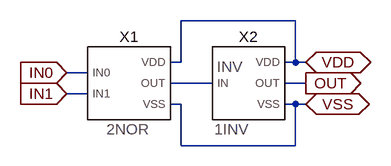
[diagram p0: schematic 2OR.asc]
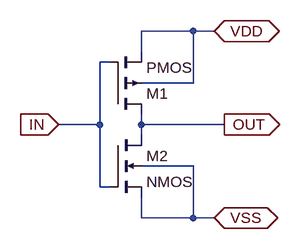
[diagram p1: sub-circuit 1inv.asc]
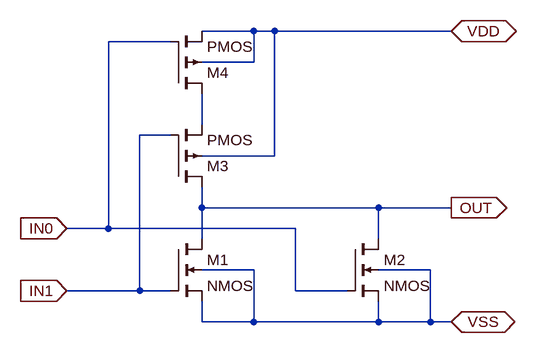
[diagram p2: sub-circuit 2nor.asc]
2OR.asc, the LTspice schematic file:
Version 4
SHEET 1 880 680
WIRE 288 64 112 64
WIRE 112 128 112 64
WIRE 112 128 96 128
WIRE 288 128 288 64
WIRE 288 128 272 128
WIRE 304 128 288 128
WIRE -32 144 -64 144
WIRE 160 160 96 160
WIRE 304 160 272 160
WIRE -32 176 -64 176
WIRE 112 192 96 192
WIRE 288 192 272 192
WIRE 304 192 288 192
WIRE 112 256 112 192
WIRE 288 256 288 192
WIRE 288 256 112 256
FLAG 304 128 VDD
IOPIN 304 128 BiDir
FLAG 304 192 VSS
IOPIN 304 192 BiDir
FLAG 304 160 OUT
IOPIN 304 160 Out
FLAG -64 144 IN0
IOPIN -64 144 In
FLAG -64 176 IN1
IOPIN -64 176 In
SYMBOL 1INV 208 160 R0
SYMATTR InstName X2
SYMBOL 2NOR 32 160 R0
SYMATTR InstName X1

1inv.asc, the sub-circuit schematic file:
Version 4
SHEET 1 880 680
WIRE 224 -16 144 -16
WIRE 256 -16 224 -16
WIRE 144 16 144 -16
WIRE 96 32 80 32
WIRE 224 64 224 -16
WIRE 224 64 144 64
WIRE 80 128 80 32
WIRE 80 128 16 128
WIRE 144 128 144 112
WIRE 272 128 144 128
WIRE 144 144 144 128
WIRE 224 192 144 192
WIRE 80 224 80 128
WIRE 96 224 80 224
WIRE 144 272 144 240
WIRE 224 272 224 192
WIRE 224 272 144 272
WIRE 256 272 224 272
FLAG 16 128 IN
IOPIN 16 128 In
FLAG 272 128 OUT
IOPIN 272 128 Out
FLAG 256 -16 VDD
IOPIN 256 -16 BiDir
FLAG 256 272 VSS
IOPIN 256 272 BiDir
SYMBOL pmos4 96 112 M180
SYMATTR InstName M1
SYMATTR Value2 l=110nM w=180nM
SYMBOL nmos4 96 144 R0
SYMATTR InstName M2
SYMATTR Value2 l=110nM w=180nM

2nor.asc, the sub-circuit schematic file:
Version 4
SHEET 1 880 680
WIRE 256 -96 176 -96
WIRE 288 -96 256 -96
WIRE 560 -96 288 -96
WIRE 128 -80 32 -80
WIRE 256 -48 256 -96
WIRE 256 -48 176 -48
WIRE 176 48 176 0
WIRE 128 64 80 64
WIRE 288 96 288 -96
WIRE 288 96 176 96
WIRE 176 176 176 144
WIRE 448 176 176 176
WIRE 560 176 448 176
WIRE 32 208 32 -80
WIRE 32 208 -32 208
WIRE 320 208 32 208
WIRE 176 224 176 176
WIRE 448 224 448 176
WIRE 256 272 176 272
WIRE 528 272 448 272
WIRE 80 304 80 64
WIRE 80 304 -32 304
WIRE 128 304 80 304
WIRE 320 304 320 208
WIRE 400 304 320 304
WIRE 176 352 176 320
WIRE 256 352 256 272
WIRE 256 352 176 352
WIRE 448 352 448 320
WIRE 448 352 256 352
WIRE 528 352 528 272
WIRE 528 352 448 352
WIRE 560 352 528 352
FLAG 560 176 OUT
IOPIN 560 176 Out
FLAG 560 -96 VDD
IOPIN 560 -96 BiDir
FLAG 560 352 VSS
IOPIN 560 352 BiDir
FLAG -32 208 IN0
IOPIN -32 208 In
FLAG -32 304 IN1
IOPIN -32 304 In
SYMBOL nmos4 128 224 R0
SYMATTR InstName M1
SYMATTR Value2 l=110u w=180u
SYMBOL nmos4 400 224 R0
SYMATTR InstName M2
SYMATTR Value2 l=110u w=180u
SYMBOL pmos4 128 144 M180
SYMATTR InstName M3
SYMATTR Value2 l=110u w=180u
SYMBOL pmos4 128 0 M180
SYMATTR InstName M4
SYMATTR Value2 l=110u w=180u

The netlist it stands for:
* 2OR.asc
XX2 N001 OUT VDD VSS 1inv
XX1 IN0 IN1 N001 VDD VSS 2nor

* block symbol definitions
.subckt 1inv IN OUT VDD VSS
M1 OUT IN VDD VDD PMOS l=110nM w=180nM
M2 OUT IN VSS VSS NMOS l=110nM w=180nM
.ends 1inv

.subckt 2nor IN0 IN1 OUT VDD VSS
M1 OUT IN1 VSS VSS NMOS l=110u w=180u
M2 OUT IN0 VSS VSS NMOS l=110u w=180u
M3 OUT IN1 N001 VDD PMOS l=110u w=180u
M4 N001 IN0 VDD VDD PMOS l=110u w=180u
.ends 2nor

.model NMOS NMOS
.model PMOS PMOS
.lib standard.mos
.backanno
.end